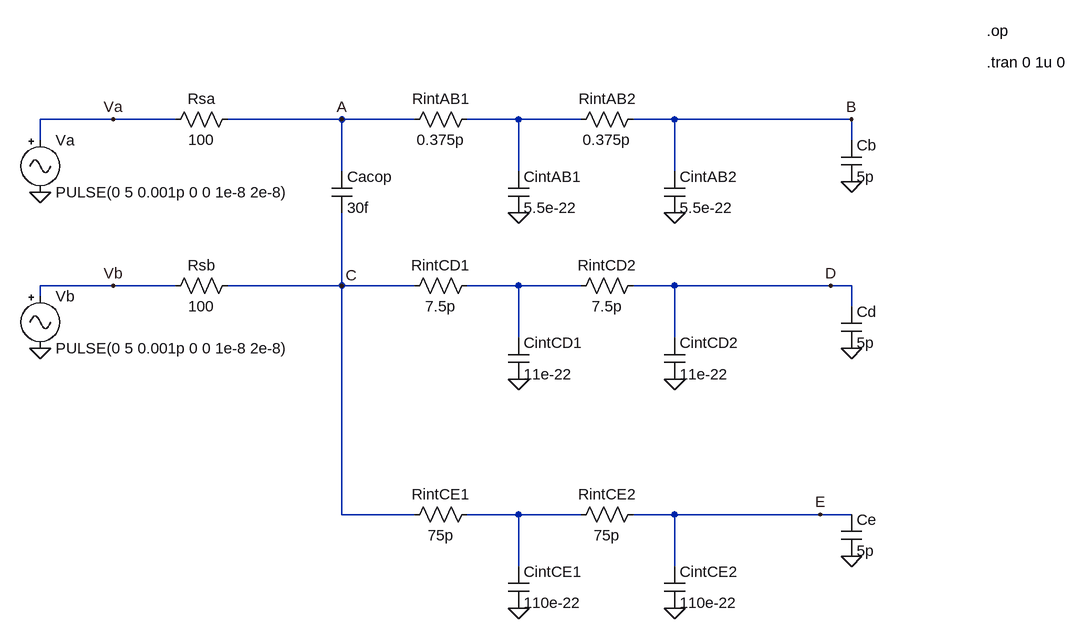
[diagram p0: schematic TrabalhoFinal_EEL7120.asc]
TrabalhoFinal_EEL7120.asc, the LTspice schematic file:
Version 4
SHEET 1 1580 852
WIRE 96 80 -16 80
WIRE 192 80 96 80
WIRE 448 80 272 80
WIRE 560 80 448 80
WIRE 720 80 640 80
WIRE 816 80 720 80
WIRE 960 80 896 80
WIRE 1232 80 960 80
WIRE -16 112 -16 80
WIRE 1232 112 1232 80
WIRE 448 160 448 80
WIRE 720 160 720 80
WIRE 960 160 960 80
WIRE 96 336 -16 336
WIRE 192 336 96 336
WIRE 448 336 448 224
WIRE 448 336 272 336
WIRE 560 336 448 336
WIRE 720 336 640 336
WIRE 816 336 720 336
WIRE 960 336 896 336
WIRE 1200 336 960 336
WIRE 1232 336 1200 336
WIRE -16 352 -16 336
WIRE 1232 368 1232 336
WIRE 720 416 720 336
WIRE 960 416 960 336
WIRE 448 688 448 336
WIRE 560 688 448 688
WIRE 720 688 640 688
WIRE 816 688 720 688
WIRE 960 688 896 688
WIRE 1184 688 960 688
WIRE 1232 688 1184 688
WIRE 720 768 720 688
WIRE 960 768 960 688
FLAG -16 192 0
FLAG -16 432 0
FLAG 1232 752 0
FLAG 1232 432 0
FLAG 1232 176 0
FLAG 448 80 A
FLAG 1232 80 B
FLAG 448 336 C
FLAG 1184 688 E
FLAG 1200 336 D
FLAG 96 336 Vb
FLAG 96 80 Va
FLAG 720 224 0
FLAG 960 224 0
FLAG 720 480 0
FLAG 960 480 0
FLAG 720 832 0
FLAG 960 832 0
SYMBOL Misc\\signal -16 336 R0
WINDOW 123 0 0 Left 0
WINDOW 39 0 0 Left 0
SYMATTR InstName Vb
SYMATTR Value PULSE(0 5 0.001p 0 0 1e-8 2e-8)
SYMBOL res 288 64 R90
WINDOW 0 0 56 VBottom 2
WINDOW 3 32 56 VTop 2
SYMATTR InstName Rsa
SYMATTR Value 100
SYMBOL res 288 320 R90
WINDOW 0 0 56 VBottom 2
WINDOW 3 32 56 VTop 2
SYMATTR InstName Rsb
SYMATTR Value 100
SYMBOL cap 1216 112 R0
SYMATTR InstName Cb
SYMATTR Value 5p
SYMBOL cap 1216 368 R0
SYMATTR InstName Cd
SYMATTR Value 5p
SYMBOL cap 1216 688 R0
SYMATTR InstName Ce
SYMATTR Value 5p
SYMBOL cap 432 160 R0
SYMATTR InstName Cacop
SYMATTR Value 30f
SYMBOL Misc\\signal -16 96 R0
WINDOW 123 0 0 Left 0
WINDOW 39 0 0 Left 0
SYMATTR InstName Va
SYMATTR Value PULSE(0 5 0.001p 0 0 1e-8 2e-8)
SYMBOL res 656 64 R90
WINDOW 0 0 56 VBottom 2
WINDOW 3 32 56 VTop 2
SYMATTR InstName RintAB1
SYMATTR Value 0.375p
SYMBOL res 912 64 R90
WINDOW 0 0 56 VBottom 2
WINDOW 3 32 56 VTop 2
SYMATTR InstName RintAB2
SYMATTR Value 0.375p
SYMBOL cap 704 160 R0
SYMATTR InstName CintAB1
SYMATTR Value 5.5e-22
SYMBOL cap 944 160 R0
SYMATTR InstName CintAB2
SYMATTR Value 5.5e-22
SYMBOL res 656 320 R90
WINDOW 0 0 56 VBottom 2
WINDOW 3 32 56 VTop 2
SYMATTR InstName RintCD1
SYMATTR Value 7.5p
SYMBOL res 912 320 R90
WINDOW 0 0 56 VBottom 2
WINDOW 3 32 56 VTop 2
SYMATTR InstName RintCD2
SYMATTR Value 7.5p
SYMBOL cap 704 416 R0
SYMATTR InstName CintCD1
SYMATTR Value 11e-22
SYMBOL cap 944 416 R0
SYMATTR InstName CintCD2
SYMATTR Value 11e-22
SYMBOL res 656 672 R90
WINDOW 0 0 56 VBottom 2
WINDOW 3 32 56 VTop 2
SYMATTR InstName RintCE1
SYMATTR Value 75p
SYMBOL res 912 672 R90
WINDOW 0 0 56 VBottom 2
WINDOW 3 32 56 VTop 2
SYMATTR InstName RintCE2
SYMATTR Value 75p
SYMBOL cap 704 768 R0
SYMATTR InstName CintCE1
SYMATTR Value 110e-22
SYMBOL cap 944 768 R0
SYMATTR InstName CintCE2
SYMATTR Value 110e-22
TEXT 1440 -56 Left 2 !.op
TEXT 1440 -8 Left 2 !.tran 0 1u 0

The netlist it stands for:
* TrabalhoFinal_EEL7120.asc
Vb Vb 0 PULSE(0 5 0.001p 0 0 1e-8 2e-8)
Rsa A Va 100
Rsb C Vb 100
Cb B 0 5p
Cd D 0 5p
Ce E 0 5p
Cacop A C 30f
Va Va 0 PULSE(0 5 0.001p 0 0 1e-8 2e-8)
RintAB1 N001 A 0.375p
RintAB2 B N001 0.375p
CintAB1 N001 0 5.5e-22
CintAB2 B 0 5.5e-22
RintCD1 N002 C 7.5p
RintCD2 D N002 7.5p
CintCD1 N002 0 11e-22
CintCD2 D 0 11e-22
RintCE1 N003 C 75p
RintCE2 E N003 75p
CintCE1 N003 0 110e-22
CintCE2 E 0 110e-22
.op
.tran 0 1u 0
.backanno
.end